# Altium project Contrller_PCB.PrjPcb
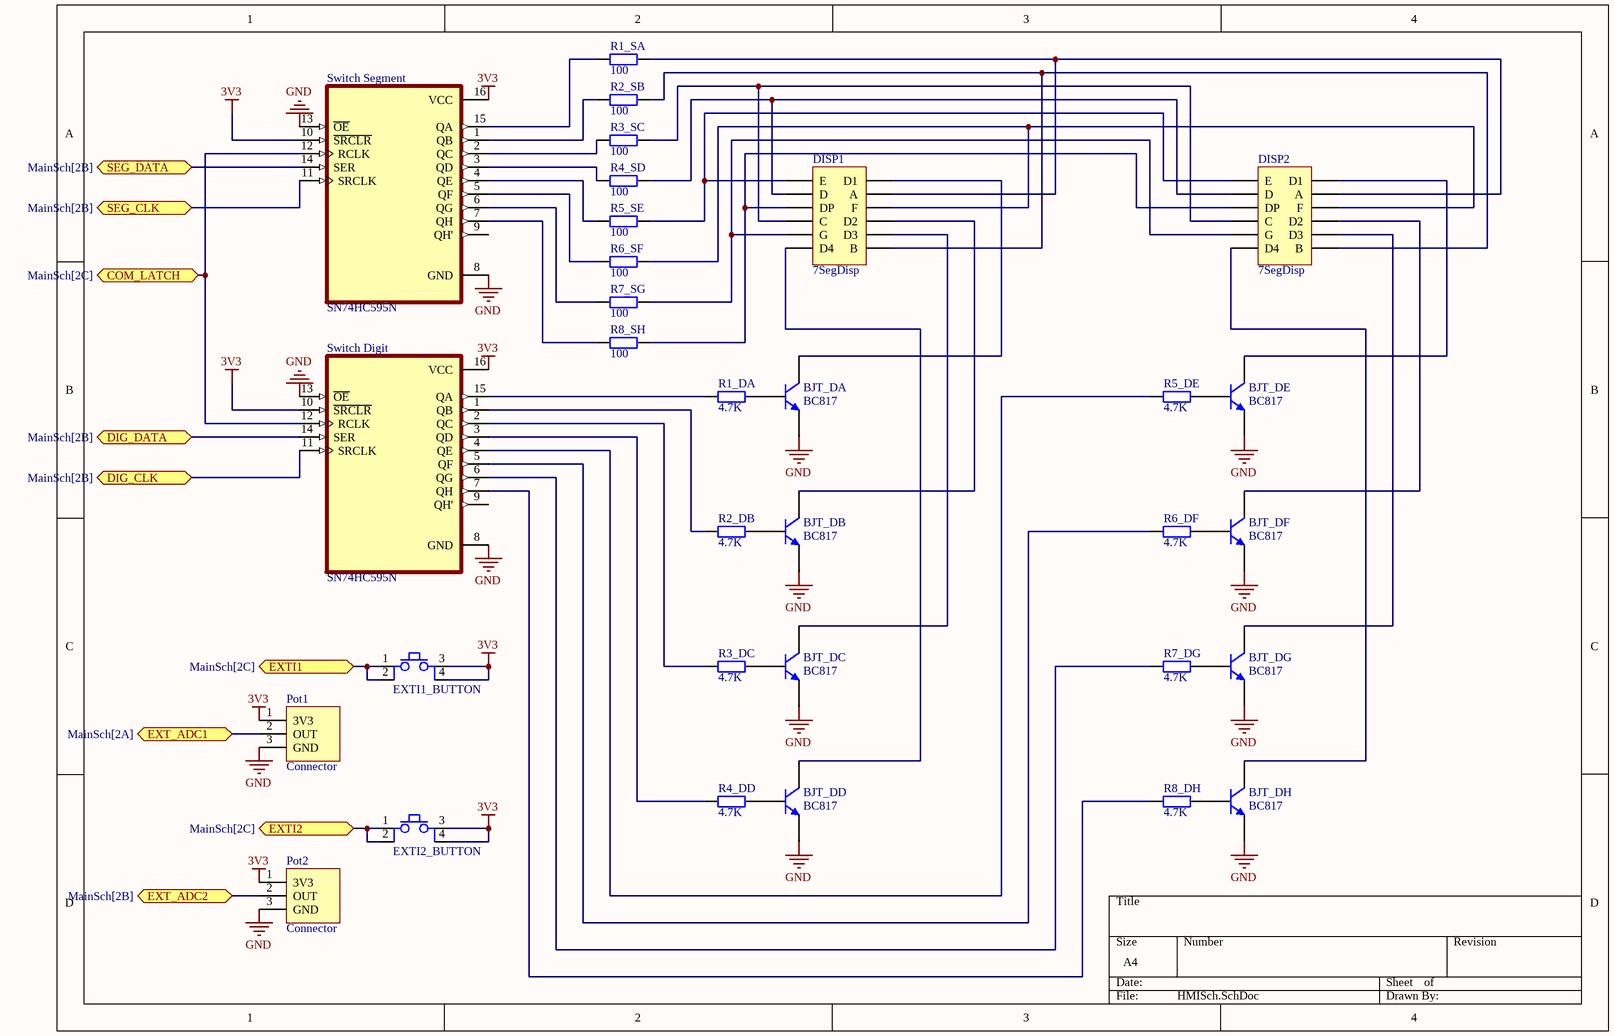
[diagram p0: HMISch.SchDoc]
2 sheets, 34 parts. Net scope: flat (ports and power ports of the same name join across sheets).
Board file: RobonAUT_PCB.PcbDoc
Sheets:
  HMISch.SchDoc
  MainSch.SchDoc

## Sheet HMISch.SchDoc
size A4; SheetNumber: 1; SheetTotal: 1

### Parts
BJT_DA  BC817  [FP_SOT23-3]
BJT_DB  BC817  [FP_SOT23-3]
BJT_DC  BC817  [FP_SOT23-3]
BJT_DD  BC817  [FP_SOT23-3]
BJT_DE  BC817  [FP_SOT23-3]
BJT_DF  BC817  [FP_SOT23-3]
BJT_DG  BC817  [FP_SOT23-3]
BJT_DH  BC817  [FP_SOT23-3]
DISP1  7SegDisp  [3461AS_FP]
DISP2  7SegDisp  [3461AS_FP]
EXTI1_BUTTON  Button  [FP_BTN_SMD]  (value not drawn)
EXTI2_BUTTON  Button  [FP_BTN_SMD]  (value not drawn)
Pot1  Connector  [Potmeter_3C_FP]
Pot2  Connector  [Potmeter_3C_FP]
R1_DA  4.7K  [FP_1206_RES]
R1_SA  100  [FP_1206_RES]
R2_DB  4.7K  [FP_1206_RES]
R2_SB  100  [FP_1206_RES]
R3_DC  4.7K  [FP_1206_RES]
R3_SC  100  [FP_1206_RES]
R4_DD  4.7K  [FP_1206_RES]
R4_SD  100  [FP_1206_RES]
R5_DE  4.7K  [FP_1206_RES]
R5_SE  100  [FP_1206_RES]
R6_DF  4.7K  [FP_1206_RES]
R6_SF  100  [FP_1206_RES]
R7_DG  4.7K  [FP_1206_RES]
R7_SG  100  [FP_1206_RES]
R8_DH  4.7K  [FP_1206_RES]
R8_SH  100  [FP_1206_RES]
Switch_Digit  SN74HC595N  [DIP794W45P254L1969H508Q16]
Switch_Segment  SN74HC595N  [DIP794W45P254L1969H508Q16]

### Ports
COM_LATCH (bidir, see MainSch[2C]), DIG_CLK (bidir, see MainSch[2B]), DIG_DATA (bidir, see MainSch[2B]), EXT_ADC1 (bidir, see MainSch[2A]), EXT_ADC2 (bidir, see MainSch[2B]), EXTI1 (bidir, see MainSch[2C]), EXTI2 (bidir, see MainSch[2C]), SEG_CLK (bidir, see MainSch[2B]), SEG_DATA (bidir, see MainSch[2B])

### Nets
3V3: EXTI1_BUTTON.3 EXTI1_BUTTON.4 EXTI2_BUTTON.3 EXTI2_BUTTON.4 Pot1.1(3V3) Pot2.1(3V3) Switch_Digit.10(~{SRCLR}) Switch_Digit.16(VCC) Switch_Segment.10(~{SRCLR}) Switch_Segment.16(VCC)
GND: BJT_DA.2(E) BJT_DB.2(E) BJT_DC.2(E) BJT_DD.2(E) BJT_DE.2(E) BJT_DF.2(E) BJT_DG.2(E) BJT_DH.2(E) Pot1.3(GND) Pot2.3(GND) Switch_Digit.8(GND) Switch_Digit.13(~{OE}) Switch_Segment.8(GND) Switch_Segment.13(~{OE})
NetBJT_DA_1: BJT_DA.1(B) R1_DA.2
NetBJT_DA_3: BJT_DA.3(C) DISP1.2(D1)
NetBJT_DB_1: BJT_DB.1(B) R2_DB.2
NetBJT_DB_3: BJT_DB.3(C) DISP1.8(D2)
NetBJT_DC_1: BJT_DC.1(B) R3_DC.2
NetBJT_DC_3: BJT_DC.3(C) DISP1.10(D3)
NetBJT_DD_1: BJT_DD.1(B) R4_DD.2
NetBJT_DD_3: BJT_DD.3(C) DISP1.11(D4)
NetBJT_DE_1: BJT_DE.1(B) R5_DE.2
NetBJT_DE_3: BJT_DE.3(C) DISP2.2(D1)
NetBJT_DF_1: BJT_DF.1(B) R6_DF.2
NetBJT_DF_3: BJT_DF.3(C) DISP2.8(D2)
NetBJT_DG_1: BJT_DG.1(B) R7_DG.2
NetBJT_DG_3: BJT_DG.3(C) DISP2.10(D3)
NetBJT_DH_1: BJT_DH.1(B) R8_DH.2
NetBJT_DH_3: BJT_DH.3(C) DISP2.11(D4)
NetDISP1_1: DISP1.1(E) DISP2.1(E) R5_SE.2
NetDISP1_3: DISP1.3(D) DISP2.3(D) R4_SD.2
NetDISP1_4: DISP1.4(A) DISP2.4(A) R1_SA.2
NetDISP1_5: DISP1.5(DP) DISP2.5(DP) R8_SH.2
NetDISP1_6: DISP1.6(F) DISP2.6(F) R6_SF.2
NetDISP1_7: DISP1.7(C) DISP2.7(C) R3_SC.2
NetDISP1_9: DISP1.9(G) DISP2.9(G) R7_SG.2
NetDISP1_12: DISP1.12(B) DISP2.12(B) R2_SB.2
NetEXTI1_BUTTON_1: EXTI1_BUTTON.1 EXTI1_BUTTON.2 ; port EXTI1
NetEXTI2_BUTTON_1: EXTI2_BUTTON.1 EXTI2_BUTTON.2 ; port EXTI2
NetPot1_2: Pot1.2(OUT) ; port EXT_ADC1
NetPot2_2: Pot2.2(OUT) ; port EXT_ADC2
NetR1_DA_1: R1_DA.1 Switch_Digit.15(QA)
NetR1_SA_1: R1_SA.1 Switch_Segment.15(QA)
NetR2_DB_1: R2_DB.1 Switch_Digit.1(QB)
NetR2_SB_1: R2_SB.1 Switch_Segment.1(QB)
NetR3_DC_1: R3_DC.1 Switch_Digit.2(QC)
NetR3_SC_1: R3_SC.1 Switch_Segment.2(QC)
NetR4_DD_1: R4_DD.1 Switch_Digit.3(QD)
NetR4_SD_1: R4_SD.1 Switch_Segment.3(QD)
NetR5_DE_1: R5_DE.1 Switch_Digit.4(QE)
NetR5_SE_1: R5_SE.1 Switch_Segment.4(QE)
NetR6_DF_1: R6_DF.1 Switch_Digit.5(QF)
NetR6_SF_1: R6_SF.1 Switch_Segment.5(QF)
NetR7_DG_1: R7_DG.1 Switch_Digit.6(QG)
NetR7_SG_1: R7_SG.1 Switch_Segment.6(QG)
NetR8_DH_1: R8_DH.1 Switch_Digit.7(QH)
NetR8_SH_1: R8_SH.1 Switch_Segment.7(QH)
NetSwitch_Digit_11: Switch_Digit.11(SRCLK) ; port DIG_CLK
NetSwitch_Digit_12: Switch_Digit.12(RCLK) Switch_Segment.12(RCLK) ; port COM_LATCH
NetSwitch_Digit_14: Switch_Digit.14(SER) ; port DIG_DATA
NetSwitch_Segment_11: Switch_Segment.11(SRCLK) ; port SEG_CLK
NetSwitch_Segment_14: Switch_Segment.14(SER) ; port SEG_DATA

Not connected (* = marked no-connect by the designer): Switch_Digit 9(QH'); Switch_Segment 9(QH')

### Library data of the parts
BJT_DA BJT_DB BJT_DC BJT_DD BJT_DE BJT_DF BJT_DG BJT_DH = BC817: NPN General-purpose Transistor; ComponentLink1Description: Manufacturer Link; ComponentLink1URL: http://www.semiconductors.philips.com/; ComponentLink2Description: Datasheet; ComponentLink2URL: http://www.semiconductors.philips.com/acrobat/datasheets/BC817_BC817W_BC337_5.pdf
DISP1 DISP2 = 3461AS: 7 segment display sch; Reference: *; Supplier: *; Name: *
EXTI1_BUTTON EXTI2_BUTTON = Button 4P: Push button
Pot1 Pot2 = Potmeter_3pin: 3pin connector
R1_DA R1_SA R2_DB R2_SB R3_DC R3_SC R4_DD R4_SD R5_DE R5_SE R6_DF R6_SF R7_DG R7_SG R8_DH R8_SH = RES: Resistor
  R1_DA R2_DB R3_DC R4_DD R5_DE R6_DF R7_DG R8_DH: Value: 4.7K
  R1_SA R2_SB R3_SC R4_SD R5_SE R6_SF R7_SG R8_SH: Value: 100
Switch_Digit Switch_Segment = SN74HC595N: Package: None; Price: None; Availability: Unavailable; MP: SN74HC595N; Value: *

## Sheet MainSch.SchDoc
size A4; SheetNumber: 2; SheetTotal: 2
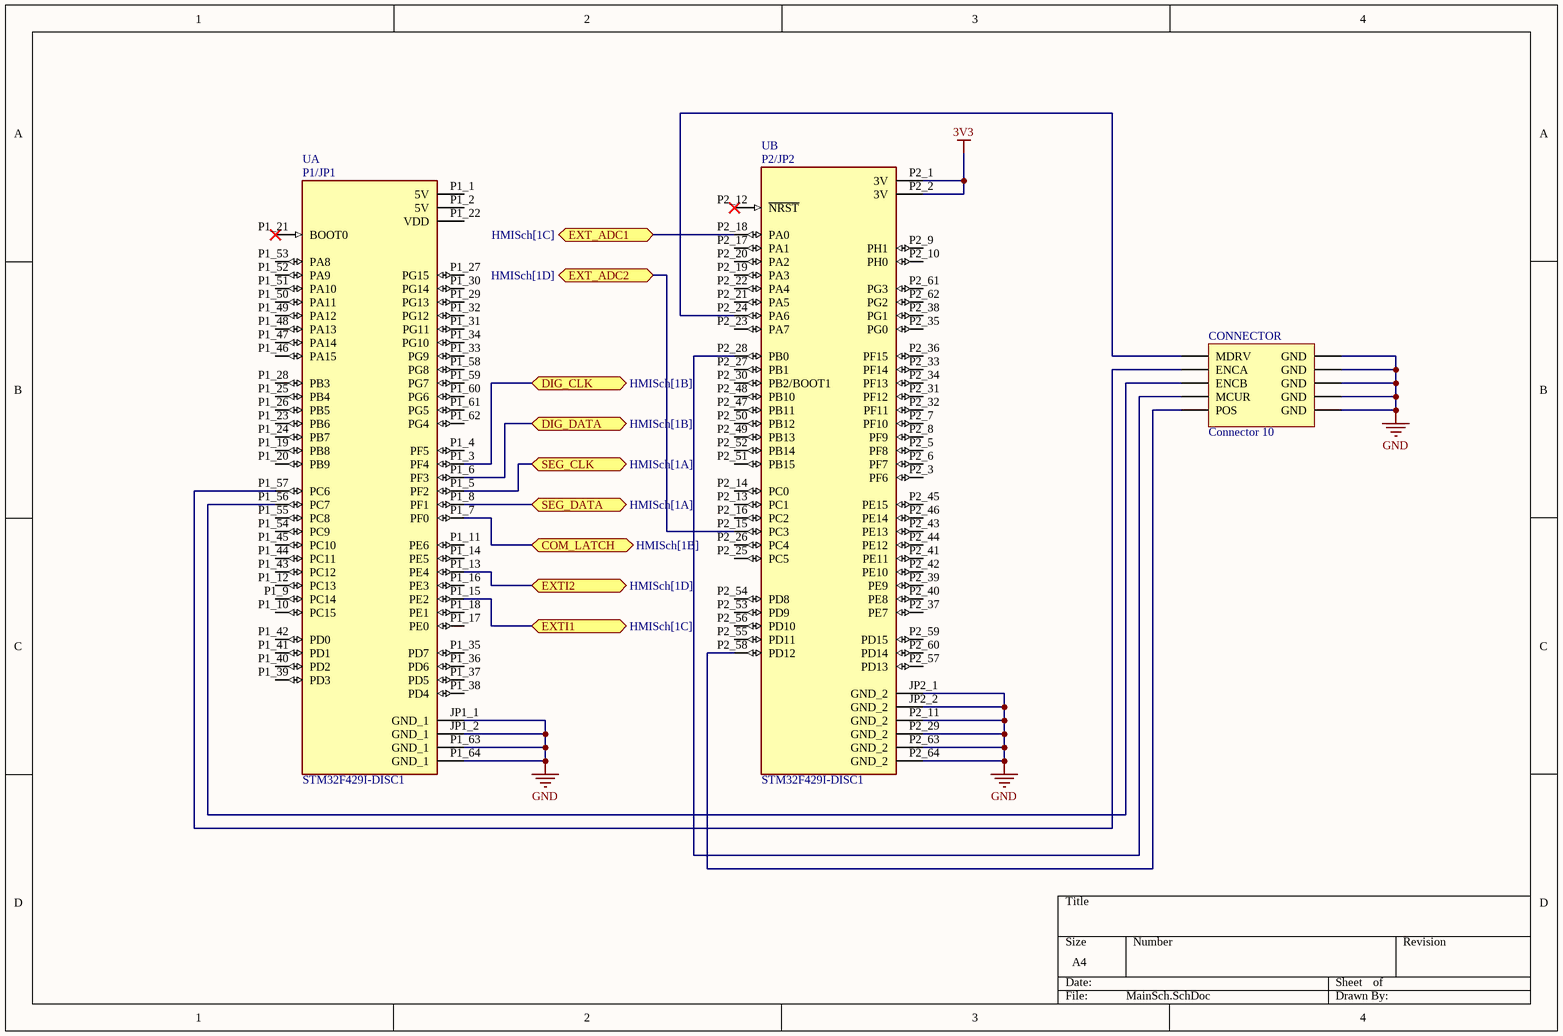
[diagram p1: MainSch.SchDoc]

### Parts
CONNECTOR  Connector 10  [CONNECTOR-10P]
U  STM32F429I-DISC1  [MODULE_STM32F429I-DISC1]  (parts A,B of 2)

### Ports
COM_LATCH (bidir, see HMISch[1B]), DIG_CLK (bidir, see HMISch[1B]), DIG_DATA (bidir, see HMISch[1B]), EXT_ADC1 (bidir, see HMISch[1C]), EXT_ADC2 (bidir, see HMISch[1D]), EXTI1 (bidir, see HMISch[1C]), EXTI2 (bidir, see HMISch[1D]), SEG_CLK (bidir, see HMISch[1A]), SEG_DATA (bidir, see HMISch[1A])

### Nets
3V3: U.P2_1(3V) U.P2_2(3V)
GND: CONNECTOR.2(GND) CONNECTOR.4(GND) CONNECTOR.6(GND) CONNECTOR.8(GND) CONNECTOR.10(GND) U.JP1_1(GND_1) U.JP1_2(GND_1) U.JP2_1(GND_2) U.JP2_2(GND_2) U.P1_63(GND_1) U.P1_64(GND_1) U.P2_11(GND_2) U.P2_29(GND_2) U.P2_63(GND_2) U.P2_64(GND_2)
NetCONNECTOR_1: CONNECTOR.1(MDRV) U.P2_24(PA6)
NetCONNECTOR_3: CONNECTOR.3(ENCA) U.P1_57(PC6)
NetCONNECTOR_5: CONNECTOR.5(ENCB) U.P1_56(PC7)
NetCONNECTOR_7: CONNECTOR.7(MCUR) U.P2_28(PB0)
NetCONNECTOR_9: CONNECTOR.9(POS) U.P2_58(PD12)
NetEXTI1_BUTTON_1: U.P1_15(PE2) ; port EXTI1
NetEXTI2_BUTTON_1: U.P1_13(PE4) ; port EXTI2
NetPot1_2: U.P2_18(PA0) ; port EXT_ADC1
NetPot2_2: U.P2_15(PC3) ; port EXT_ADC2
NetSwitch_Digit_11: U.P1_3(PF4) ; port DIG_CLK
NetSwitch_Digit_12: U.P1_7(PF0) ; port COM_LATCH
NetSwitch_Digit_14: U.P1_6(PF3) ; port DIG_DATA
NetSwitch_Segment_11: U.P1_5(PF2) ; port SEG_CLK
NetSwitch_Segment_14: U.P1_8(PF1) ; port SEG_DATA

Not connected (* = marked no-connect by the designer): U P1_1(5V) P1_2(5V) P1_4(PF5) P1_9(PC14) P1_10(PC15) P1_11(PE6) P1_12(PC13) P1_14(PE5) P1_16(PE3) P1_17(PE0) P1_18(PE1) P1_19(PB8) P1_20(PB9) P1_21(BOOT0)* P1_22(VDD) P1_23(PB6) P1_24(PB7) P1_25(PB4) P1_26(PB5) P1_27(PG15) P1_28(PB3) P1_29(PG13) P1_30(PG14) P1_31(PG11) P1_32(PG12) P1_33(PG9) P1_34(PG10) P1_35(PD7) P1_36(PD6) P1_37(PD5) P1_38(PD4) P1_39(PD3) P1_40(PD2) P1_41(PD1) P1_42(PD0) P1_43(PC12) P1_44(PC11) P1_45(PC10) P1_46(PA15) P1_47(PA14) P1_48(PA13) P1_49(PA12) P1_50(PA11) P1_51(PA10) P1_52(PA9) P1_53(PA8) P1_54(PC9) P1_55(PC8) P1_58(PG8) P1_59(PG7) P1_60(PG6) P1_61(PG5) P1_62(PG4) P2_3(PF6) P2_5(PF8) P2_6(PF7) P2_7(PF10) P2_8(PF9) P2_9(PH1) P2_10(PH0) P2_12(~{NRST})* P2_13(PC1) P2_14(PC0) P2_16(PC2) P2_17(PA1) P2_19(PA3) P2_20(PA2) P2_21(PA5) P2_22(PA4) P2_23(PA7) P2_25(PC5) P2_26(PC4) P2_27(PB1) P2_30(PB2/BOOT1) P2_31(PF12) P2_32(PF11) P2_33(PF14) P2_34(PF13) P2_35(PG0) P2_36(PF15) P2_37(PE7) P2_38(PG1) P2_39(PE9) P2_40(PE8) P2_41(PE11) P2_42(PE10) P2_43(PE13) P2_44(PE12) P2_45(PE15) P2_46(PE14) P2_47(PB11) P2_48(PB10) P2_49(PB13) P2_50(PB12) P2_51(PB15) P2_52(PB14) P2_53(PD9) P2_54(PD8) P2_55(PD11) P2_56(PD10) P2_57(PD13) P2_59(PD15) P2_60(PD14) P2_61(PG3) P2_62(PG2)

### Notes on the sheet
- (in symbol STM32F429I-DISC1, part A) P1/JP1
- (in symbol STM32F429I-DISC1, part B) P2/JP2

### Library data of the parts
CONNECTOR = Connector 10 spec: Special 10 pin ribbon connector; Reference: *; Supplier: *; Name: *
U = STM32F429I-DISC1: STM32F429 Discovery STM32F4 ARMÂ® CortexÂ®-M4 MCU 32-Bit Embedded Evaluation Board; MF: STMicroelectronics; SnapEDA_Link: https://www.snapeda.com/parts/STM32F429I-DISC1/STMicroelectronics/view-part/504905/?ref=snap; MP: STM32F429I-DISC1; Price: None; Value: *; Availability: Unavailable; Package: SOIC-14 STMicroelectronics

## Nets that join several sheets
3V3: HMISch (10 pins), MainSch (U.P2_1 U.P2_2)
GND: HMISch (14 pins), MainSch (15 pins)
NetEXTI1_BUTTON_1: HMISch (EXTI1_BUTTON.1 EXTI1_BUTTON.2), MainSch (U.P1_15)
NetEXTI2_BUTTON_1: HMISch (EXTI2_BUTTON.1 EXTI2_BUTTON.2), MainSch (U.P1_13)
NetPot1_2: HMISch (Pot1.2), MainSch (U.P2_18)
NetPot2_2: HMISch (Pot2.2), MainSch (U.P2_15)
NetSwitch_Digit_11: HMISch (Switch_Digit.11), MainSch (U.P1_3)
NetSwitch_Digit_12: HMISch (Switch_Digit.12 Switch_Segment.12), MainSch (U.P1_7)
NetSwitch_Digit_14: HMISch (Switch_Digit.14), MainSch (U.P1_6)
NetSwitch_Segment_11: HMISch (Switch_Segment.11), MainSch (U.P1_5)
NetSwitch_Segment_14: HMISch (Switch_Segment.14), MainSch (U.P1_8)